# Altium schematic sheet Sheet_stair.SchDoc
size A0; Organization: Altium Limited; Address1: L3, 12a Rodborough Rd; Address2: Frenchs Forest; Address3: NSW; Address4: Australia 2086
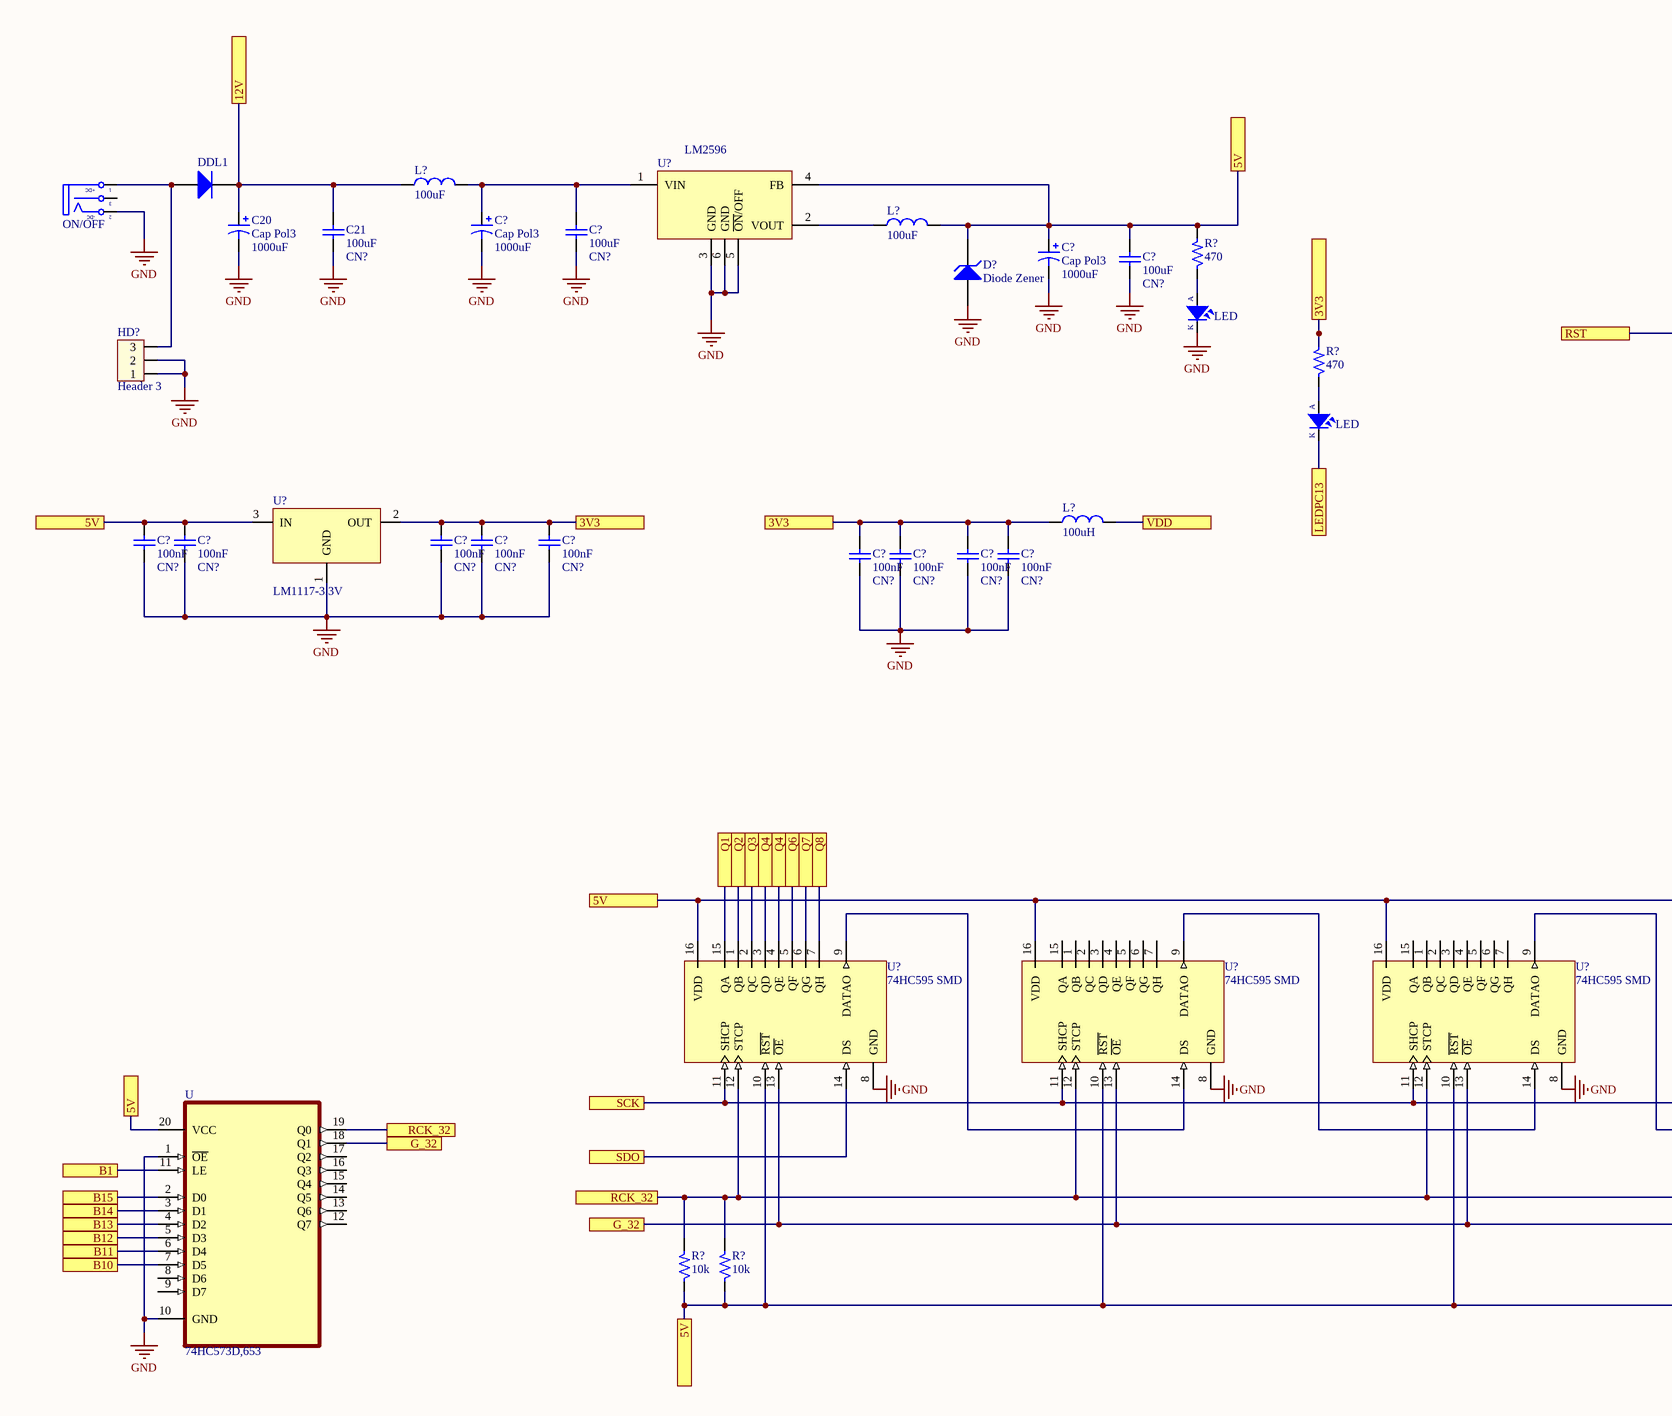
[diagram p0: Sheet_stair.SchDoc, top left]
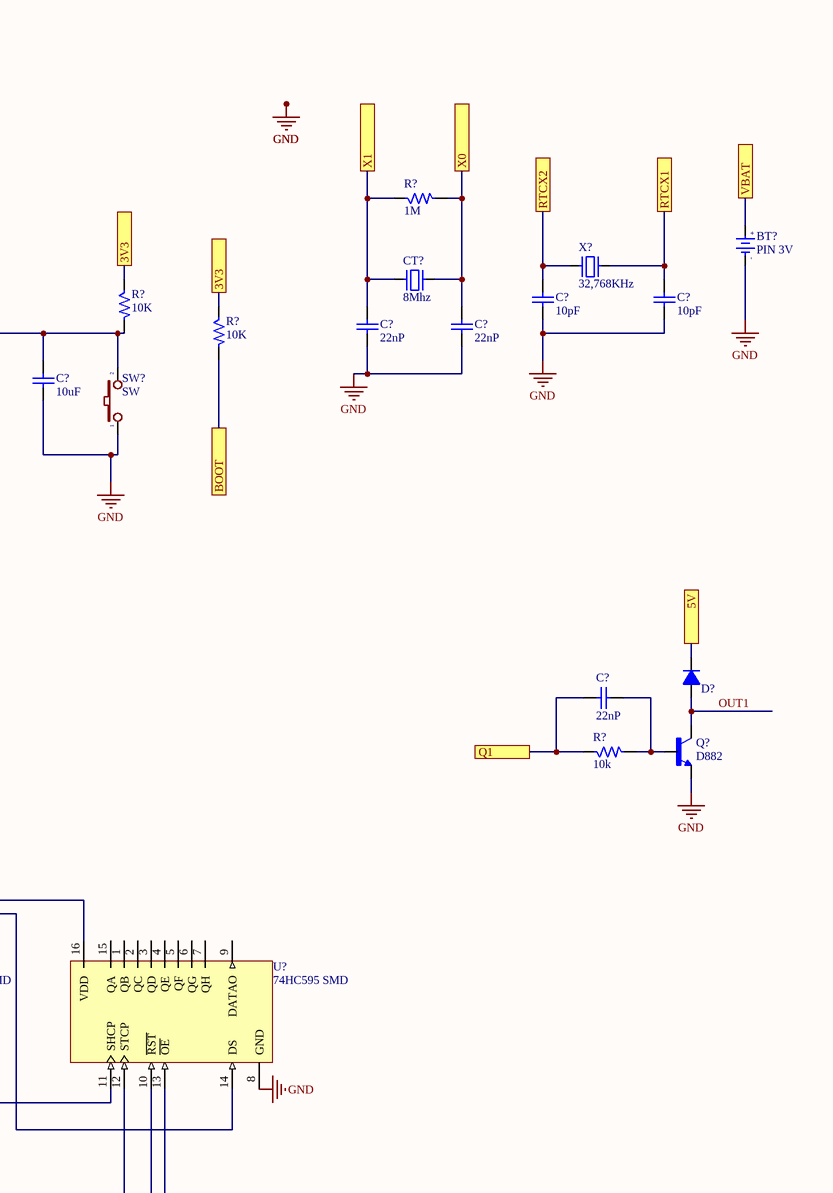
[diagram p1: Sheet_stair.SchDoc, top right]
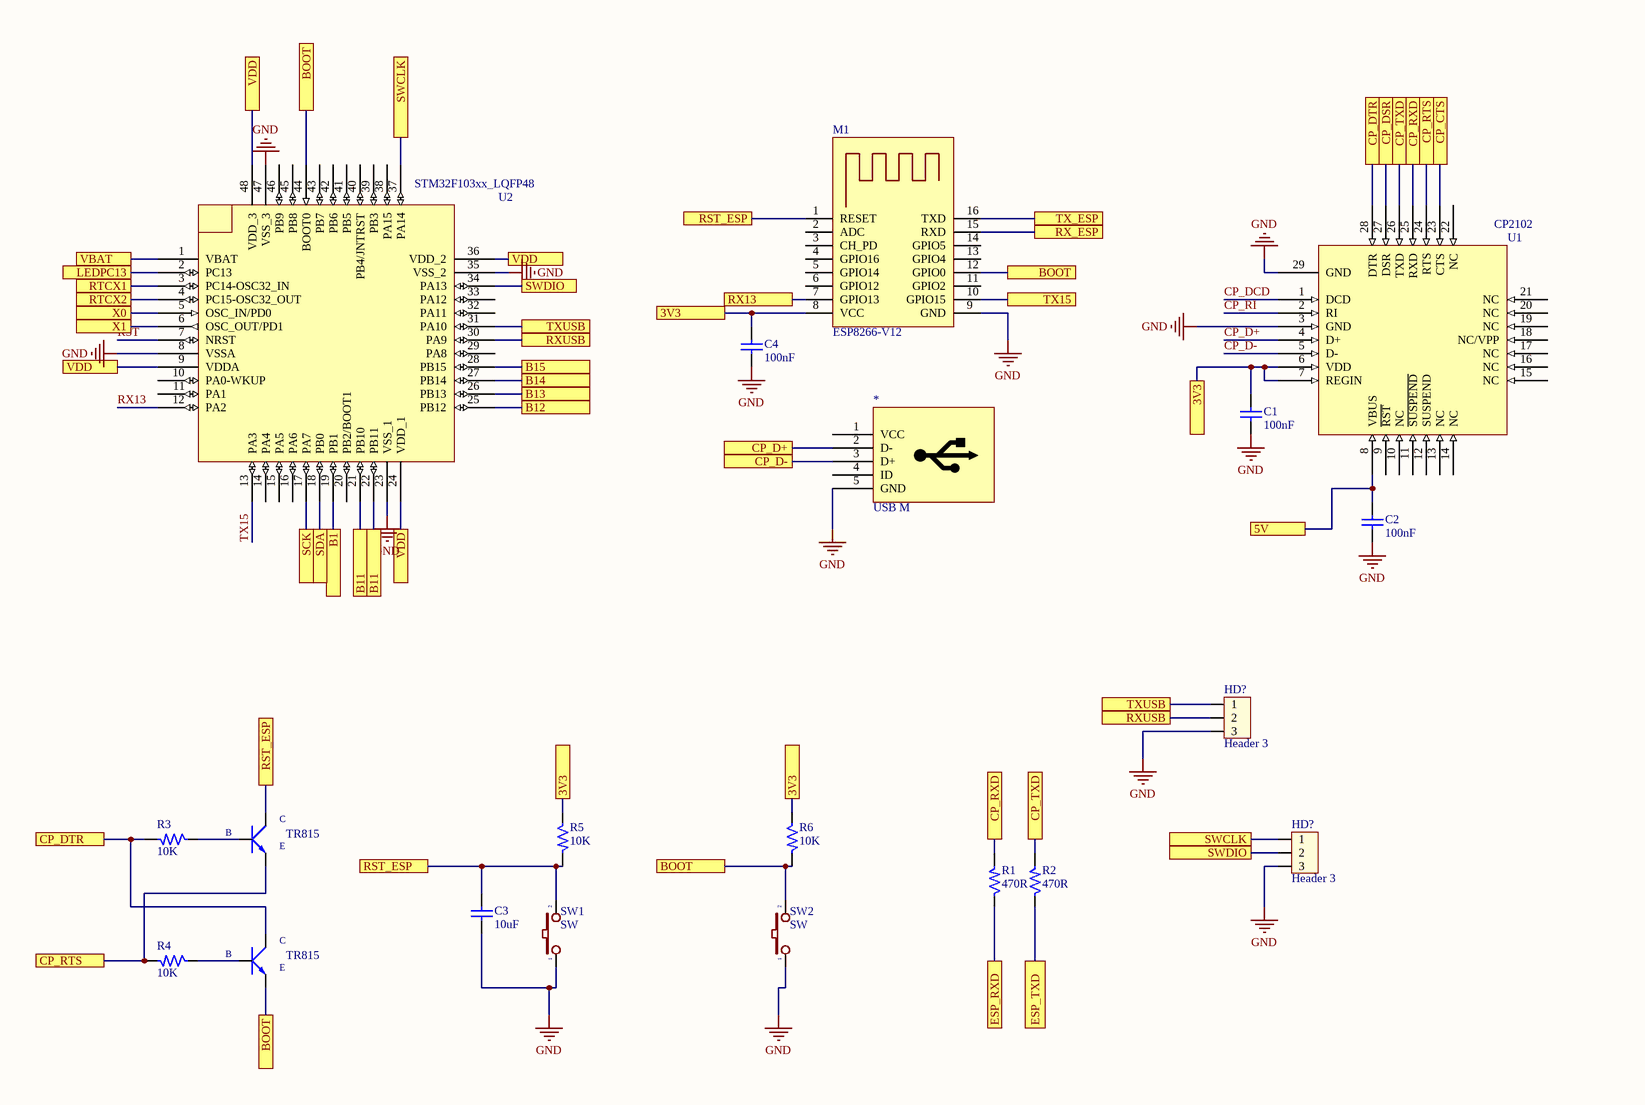
[diagram p2: Sheet_stair.SchDoc, bottom left]

## Parts
(Parts that share a designator on the sheet are numbered #1, #2 ... from top to bottom, then left to right.)
*  USB M  [USB-Micr-B-FCI-SMD]
BT?  PIN 3V  [PIN3V - CR2032]
C1  100nF  [103/2KV]
C2  100nF  [103/2KV]
C3  10uF  [103/2KV]
C4  100nF  [103/2KV]
C20  Cap Pol3  value 1000uF  [CP2/5]
C21  100uF  value CN?  [CNP]
C?#1  Cap Pol3  value 1000uF  [CP2/5]
C?#2  100uF  value CN?  [CNP]
C?#3  Cap Pol3  value 1000uF  [CP2/5]
C?#4  100uF  value CN?  [CNP]
C?#5  10pF  [103/2KV]
C?#6  10pF  [103/2KV]
C?#7  22nP  [103/2KV]
C?#8  22nP  [103/2KV]
C?#9  10uF  [103/2KV]
C?#10  100nF  value CN?  [CNP]
C?#11  100nF  value CN?  [CNP]
C?#12  100nF  value CN?  [CNP]
C?#13  100nF  value CN?  [CNP]
C?#14  100nF  value CN?  [CNP]
C?#15  100nF  value CN?  [CNP]
C?#16  100nF  value CN?  [CNP]
C?#17  100nF  value CN?  [CNP]
C?#18  100nF  value CN?  [CNP]
C?#19  22nP  [103/2KV]
CT?  8Mhz  [CRYSTAL SMD 32,768 kHz]
D?#1  Diode Zener  [DIODE/NOM/0.5A]
D?#2  Diode  1N4007  [DO-214AC]  (value not drawn)
DDL1  Diode  [D5AN]  (value not drawn)
HD?#1  Header 3  [HED3]
HD?#2  Header 3  [HED3]
HD?#3  Header 3  [HED3]
L?#1  100uF  [L/0.4]
L?#2  100uF  [L/0.4]
L?#3  100uH  [L/0.4]
LED?#1  LED  [LED-3]
LED?#2  LED  [LED-3]
M1  ESP8266-V12  [ESP8266 ESP_12]
ON/OFF  POWER  [DC-IN]  (value not drawn)
Q?  D882  [TO-252]
R1  470R  [R1/4W]
R2  470R  [R1/4W]
R3  10K  [R1/4W]
R4  10K  [R1/4W]
R5  10K  [R1/4W]
R6  10K  [R1/4W]
R?#1  1M  [R1/4W]
R?#2  470  [R1/4W]
R?#3  10K  [R1/4W]
R?#4  10K  [R1/4W]
R?#5  470  [R1/4W]
R?#6  10k  [R1/4W]
R?#7  10k  [R1/4W]
R?#8  10k  [R1/4W]
STA.TR1  TR815  [QTO-92]
STA.TR2  TR815  [QTO-92]
SW1  SW  [SW2]
SW2  SW  [SW2]
SW?  SW  [SW2]
U  74HC573D,653  [SOIC127P1032X265-20N]
U1  CP2102  [cp2102]
U2  STM32F103xx_LQFP48  [STM32_LQPF48]
U?#1  LM2596  [TO263-5]
U?#2  LM1117-3.3V  [SOT223]
U?#3  74HC595 SMD  [SOP 16]
U?#4  74HC595 SMD  [SOP 16]
U?#5  74HC595 SMD  [SOP 16]
U?#6  74HC595 SMD  [SOP 16]
X?  32,768KHz  [XT2]

## Ports
3V3, 5V, 12V, B1, B10, B11, B12, B13, B14, B15, BOOT, CP_CTS, CP_D+, CP_D-, CP_DSR, CP_DTR, CP_RTS, CP_RXD, CP_TXD, ESP_RXD, ESP_TXD, G_32, LEDPC13, Q1, Q2, Q3, Q4, Q6, Q7, Q8, RCK_32, RST, RST_ESP, RTCX1, RTCX2, RX13, RX_ESP, RXUSB, SCK, SDA, SDO, SWCLK, SWDIO, TX15, TX_ESP, TXUSB, VBAT, VDD, X0, X1

## Nets
GND: *.5(GND) BT?.2(GND) C1.1 C2.1 C3.1 C4.1 C20.2 C21.1 C?#1.2 C?#2.1 C?#3.2 C?#4.1 C?#5.1 C?#6.1 C?#7.1 C?#8.1 C?#9.1 C?#10.1 C?#11.1 C?#12.1 C?#13.1 C?#14.1 C?#15.1 C?#16.1 C?#17.1 C?#18.1 D?#1.1(A) HD?#1.1 HD?#1.2 HD?#2.3 HD?#3.3 LED?#1.2(K) M1.9(GND) ON/OFF.2(TN) Q?.2(E) SW1.1 SW2.1 SW?.1 U.1(~{OE}) U.10(GND) U1.3(GND) U1.29(GND) U2.8(VSSA) U2.23(VSS_1) U2.35(VSS_2) U2.47(VSS_3) U?#1.3(GND) U?#1.5(~{ON}/OFF) U?#1.6(GND) U?#2.1(GND) U?#3.8(GND) U?#4.8(GND) U?#5.8(GND) U?#6.8(GND)
3V3: C1.2 C4.2 C?#12.2 C?#13.2 C?#14.2 C?#15.2 C?#16.2 C?#17.2 C?#18.2 L?#3.1 M1.8(VCC) R5.1 R6.1 R?#3.1 R?#4.1 R?#5.2 U1.6(VDD) U1.7(REGIN) U?#2.2(OUT) ; port 3V3
5V: C2.2 C?#3.1 C?#4.2 C?#10.2 C?#11.2 D?#1.2(K) D?#2.K L?#2.2 R?#2.2 R?#7.1 R?#8.1 U.20(VCC) U1.8(VBUS) U?#1.4(FB) U?#2.3(IN) U?#3.10(~{RST}) U?#3.16(VDD) U?#4.10(~{RST}) U?#4.16(VDD) U?#5.10(~{RST}) U?#5.16(VDD) U?#6.10(~{RST}) U?#6.16(VDD) ; port 5V
12V: C20.1 C21.2 DDL1.2(K) L?#1.1 ; port 12V
B1: U.11(LE) U2.19(PB1) ; port B1
B10: U.7(D5) ; port B10
B11: U.6(D4) U2.21(PB10) U2.22(PB11) ; port B11
B12: U.5(D3) U2.25(PB12) ; port B12
B13: U.4(D2) U2.26(PB13) ; port B13
B14: U.3(D1) U2.27(PB14) ; port B14
B15: U.2(D0) U2.28(PB15) ; port B15
BOOT: M1.12(GPIO0) R6.2 R?#4.2 STA.TR2.1(E) SW2.2 U2.44(BOOT0) ; port BOOT
CP_CTS: U1.23(CTS) ; port CP_CTS
CP_D+: U1.4(D+)
CP_D+: *.2(D-) ; port CP_D+  [a separate net that carries the same name]
CP_D-: U1.5(D-)
CP_D-: *.3(D+) ; port CP_D-  [a separate net that carries the same name]
CP_DCD: U1.1(DCD)
CP_DSR: U1.27(DSR) ; port CP_DSR
CP_DTR: R3.2 STA.TR2.2(C) U1.28(DTR) ; port CP_DTR
CP_RI: U1.2(RI)
CP_RTS: R4.2 STA.TR1.1(E) U1.24(RTS) ; port CP_RTS
CP_RXD: R1.2 U1.25(RXD) ; port CP_RXD
CP_TXD: R2.2 U1.26(TXD) ; port CP_TXD
ESP_RXD: R1.1 ; port ESP_RXD
ESP_TXD: R2.1 ; port ESP_TXD
G_32: U.18(Q1) U?#3.13(~{OE}) U?#4.13(~{OE}) U?#5.13(~{OE}) U?#6.13(~{OE}) ; port G_32
LEDPC13: LED?#2.2(K) U2.2(PC13) ; port LEDPC13
OUT1: D?#2.A Q?.3(C)
Q1: C?#19.1 R?#6.1 U?#3.15(QA) ; port Q1
Q2: U?#3.1(QB) ; port Q2
Q3: U?#3.2(QC) ; port Q3
Q4: U?#3.3(QD) U?#3.4(QE) ; port Q4
Q6: U?#3.5(QF) ; port Q6
Q7: U?#3.6(QG) ; port Q7
Q8: U?#3.7(QH) ; port Q8
RCK_32: R?#7.2 R?#8.2 U.19(Q0) U?#3.12(STCP) U?#4.12(STCP) U?#5.12(STCP) U?#6.12(STCP) ; port RCK_32
RST: U2.7(NRST)
RST: C?#9.2 R?#3.2 SW?.2 ; port RST  [a separate net that carries the same name]
RST_ESP: C3.2 M1.1(RESET) R5.2 STA.TR1.2(C) SW1.2 ; port RST_ESP
RTCX1: C?#6.2 U2.3(PC14-OSC32_IN) X?.2 ; port RTCX1
RTCX2: C?#5.2 U2.4(PC15-OSC32_OUT) X?.1 ; port RTCX2
RX13: M1.7(GPIO13) ; port RX13
RX13: U2.12(PA2)  [a separate net that carries the same name]
RX_ESP: M1.15(RXD) ; port RX_ESP
RXUSB: HD?#2.2 U2.30(PA9) ; port RXUSB
SCK: U2.17(PA7) U?#3.11(SHCP) U?#4.11(SHCP) U?#5.11(SHCP) U?#6.11(SHCP) ; port SCK
SDA: U2.18(PB0) ; port SDA
SDO: U?#3.14(DS) ; port SDO
SWCLK: HD?#3.1 U2.37(PA14) ; port SWCLK
SWDIO: HD?#3.2 U2.34(PA13) ; port SWDIO
TX15: M1.10(GPIO15) ; port TX15
TX15: U2.13(PA3)  [a separate net that carries the same name]
TX_ESP: M1.16(TXD) ; port TX_ESP
TXUSB: HD?#2.1 U2.31(PA10) ; port TXUSB
VBAT: BT?.1(+3V) U2.1(VBAT) ; port VBAT
VDD: L?#3.2 U2.9(VDDA) U2.24(VDD_1) U2.36(VDD_2) U2.48(VDD_3) ; port VDD
X0: C?#8.2 CT?.2 R?#1.2 U2.5(OSC_IN/PD0) ; port X0
X1: C?#7.2 CT?.1 R?#1.1 U2.6(OSC_OUT/PD1) ; port X1
NetC?#1_1: C?#1.1 C?#2.2 L?#1.2 U?#1.1(VIN)
NetC?#19_2: C?#19.2 Q?.1(B) R?#6.2
NetDDL1_1: DDL1.1(A) HD?#1.3 ON/OFF.1(T)
NetL?#2_1: L?#2.1 U?#1.2(VOUT)
NetLED?#1_1: LED?#1.1(A) R?#2.1
NetLED?#2_1: LED?#2.1(A) R?#5.1
NetR3_1: R3.1 STA.TR1.3(B)
NetR4_1: R4.1 STA.TR2.3(B)
NetU?#3_9: U?#3.9(DATAO) U?#4.14(DS)
NetU?#4_9: U?#4.9(DATAO) U?#5.14(DS)
NetU?#5_9: U?#5.9(DATAO) U?#6.14(DS)

Not connected (* = marked no-connect by the designer): * 1(VCC) 4(ID); M1 2(ADC) 3(CH_PD) 4(GPIO16) 5(GPIO14) 6(GPIO12) 11(GPIO2) 13(GPIO4) 14(GPIO5); ON/OFF 3(S); U 8(D6) 9(D7) 12(Q7) 13(Q6) 14(Q5) 15(Q4) 16(Q3) 17(Q2); U1 9(~{RST}) 10(NC) 11(~{SUSPEND}) 12(SUSPEND) 13(NC) 14(NC) 15(NC) 16(NC) 17(NC) 18(NC/VPP) 19(NC) 20(NC) 21(NC) 22(NC); U2 10(PA0-WKUP) 11(PA1) 14(PA4) 15(PA5) 16(PA6) 20(PB2/BOOT1) 29(PA8) 32(PA11) 33(PA12) 38(PA15) 39(PB3) 40(PB4/JNTRST) 41(PB5) 42(PB6) 43(PB7) 45(PB8) 46(PB9); U?#4 1(QB) 2(QC) 3(QD) 4(QE) 5(QF) 6(QG) 7(QH) 15(QA); U?#5 1(QB) 2(QC) 3(QD) 4(QE) 5(QF) 6(QG) 7(QH) 15(QA); U?#6 1(QB) 2(QC) 3(QD) 4(QE) 5(QF) 6(QG) 7(QH) 9(DATAO) 15(QA)

## Notes on the sheet
- Title
- Size:
- Date:
- File:
- A0
- Number:
- Time:
- Revision:
- Sheet
- of
- (in symbol DCIN) +DC; -DC
- (in symbol PIN 3V) +; -

## Library data of the parts
BT? = PIN 3V: Battery 3VDC; Value: PIN 3V
C1-C4 C?#5-C?#9 C?#19 = Cap 2KV: Capacitor Ceramic 2KV; Published: 8-Jun-2000; LatestRevisionDate: 17-Jul-2002; LatestRevisionNote: Re-released for DXP Platform.; PackageReference: RAD-0.3; Publisher: Altium Limited
C20 C?#1 C?#3 = Cap Pol3_2: Polarized Capacitor (Surface Mount); VALUE: C?; LatestRevisionDate: 17-Jul-2002; LatestRevisionNote: Re-released for DXP Platform.; PackageReference: C0805; Publisher: Altium Limited
C21 C?#2 C?#4 C?#10-C?#18 = Cap Semi: Capacitor (Semiconductor SIM Model); Value: 104; LatestRevisionDate: 17-Jul-2002; LatestRevisionNote: Re-released for DXP Platform.; PackageReference: C1206; Publisher: Altium Limited
CT? = CRYSTAL: Crystal For all Crystal 2pin.; Value: 4Mhz
D?#1 = Diode Zener: Zener Diode; Published: 8-Jun-2000; LatestRevisionDate: 17-Jul-2002; LatestRevisionNote: Re-released for DXP Platform.; PackageReference: DIODE-0.7; Publisher: Altium Limited
D?#2 = Diode  1N4007: Diode 1A; Value: 1N4007
DDL1 = Diode_1: Default Diode; Code - JEDEC: DO-214-AB; Value: 1N5007; Published: 8-Jun-2000; Revision: July-2002: Re-released for DXP Platform.; Publisher: Altium Limited
HD?#1-HD?#3 = Hed3: Header 3 (Green); Value: Header 3
L?#1-L?#3 = L1: Inductor; Value: 150 mH
LED?#1 LED?#2 = LED: LED Single colour Green and Red; Value: LED 3 ly Single Colour
M1 = WIFI_ESP8266-V12
ON/OFF = DCIN
Q? = D882: SWITCH SNAP ACT SPST-NO 5A 125V; MF: Microdiode Electronics; Price: None; Availability: In Stock; MP: D882; Package: None; SnapEDA_Link: https://www.snapeda.com/parts/D882/Applied+Avionics/view-part/?ref=snap; Check_prices: https://www.snapeda.com/parts/D882/Applied+Avionics/view-part/?ref=eda; Value: *
R1-R6 R?#1-R?#8 = Res
STA.TR1 STA.TR2 = C1815: NPN 600mW, ECB; Value: C1815
SW1 SW2 SW? = SW2: Switch button 2 pin; Value: SW chip 2 pin
U = 74HC573D,653: D-Type Ø´ÙØ§Ù Ú†ÙØª 1 Ú©Ø§Ù†Ø§Ù„ 8: 8 Ø¢ÛŒ Ø³ÛŒ Ø³Ù‡ Ø­Ø§Ù„Øª 20-SO; MF: Nexperia USA; Availability: Unavailable; SnapEDA_Link: https://www.snapeda.com/parts/74HC573D%2C653/Nexperia%20USA%20Inc./view-part/1223971/?ref=snap; Price: None; MP: 74HC573D,653; Package: SO-20 Nexperia; Value: *
U2 = STM32F103xx_LQFP48: STM32 ARM-based 32-bit MCU with 64 Kbytes Flash, 48-pin LQFP, Industrial Temperature; Published: 30-May-2008; DatasheetVersion: rev6, Mar-2008; PackageVersion: Mar-2008; PackageReference: LQFP48; Publisher: Altium Limited; PackageDescription: 48-Pin Low-Profile Quad Flat Pack, 7 x 7 mm Body, 0.5 mm Pitch (LQFP48); ComponentLink1Description: Manufacturer Link; ComponentLink1URL: www.st.com/stm32; ComponentLink2Description: Datasheet; ComponentLink2URL: http://www.st.com/stonline/products/literature/ds/13587.pdf
U?#1 = LM2596: 1A Regulator
U?#2 = LM1117: 800mA Low-Dropout Linear Regulator; Creator: Nguyen Ba Bien; Website: http://group3i.net
U?#3-U?#6 = 74HC595 SMD: Dán; Ten_Linh_Kien: 74HC595D SOP16; Don_Vi: Con; Ma_Hang: MH000672; Ghi_Chu: *; Kieu_Chan: *; Chung_Loai: Dán
X? = XT2: Crystal For all Crystal 2pin.; Value: 4Mhz